# Altium schematic sheet FPGA核心板02.SchDoc
size A4
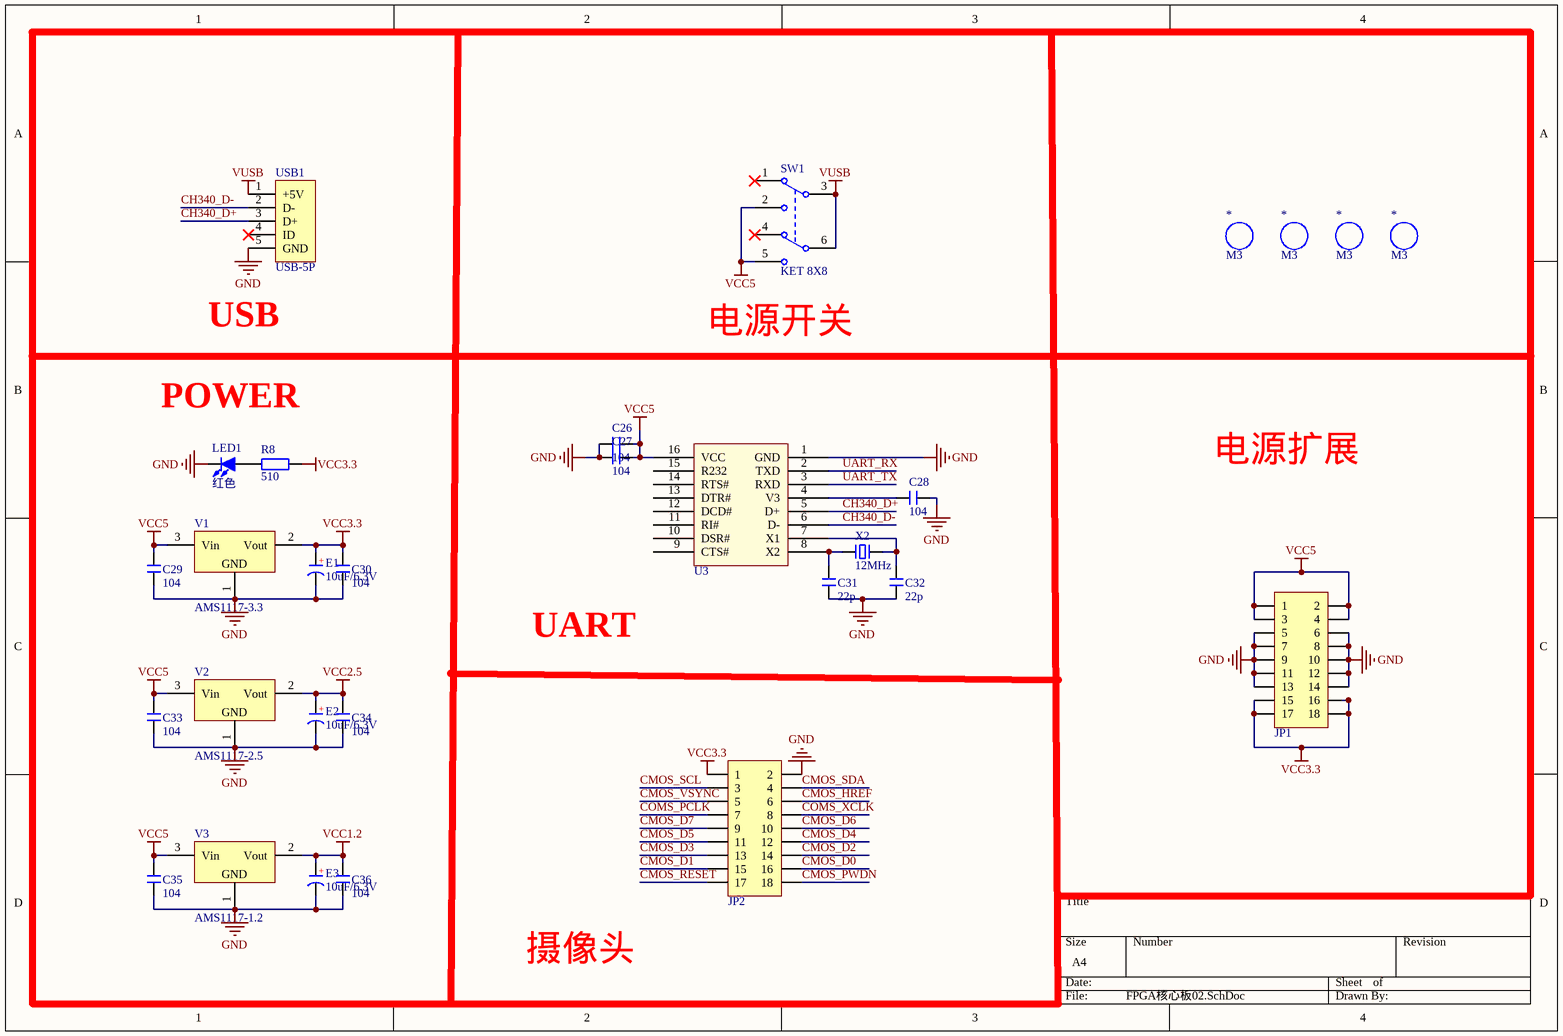
[diagram p0: FPGA核心板02.SchDoc]

## Parts
(Parts that share a designator on the sheet are numbered #1, #2 ... from top to bottom, then left to right.)
*#1  M3  [M3 125X300]
*#2  M3  [M3 125X300]
*#3  M3  [M3 125X300]
*#4  M3  [M3 125X300]
C26  104  [C 0603_L]
C27  104  [C 0603_L]
C28  104  [C 0603_L]
C29  104  [C 0603_L]
C30  104  [C 0603_L]
C31  22p  [C 0603_L]
C32  22p  [C 0603_L]
C33  104  [C 0603_L]
C34  104  [C 0603_L]
C35  104  [C 0603_L]
C36  104  [C 0603_L]
E1  10uF/6.3V  [CD A(3216)]
E2  10uF/6.3V  [CD A(3216)]
E3  10uF/6.3V  [CD A(3216)]
JP1  Header 9X2  [HDR2.54-LI-2x9P]  (value not drawn)
JP2  Header 9X2  [HDR2.54-WI-2x9P]  (value not drawn)
LED1  红色  [LED 0805B]
R8  510  [R 0603_L]
SW1  KET 8X8  [KFT DIP-8X8]
U3  CH340G  [sop16_L]  (value not drawn)
USB1  USB-5P  [USB-MICRO_B]
V1  AMS1117-3.3  [SOT223_L]
V2  AMS1117-2.5  [SOT223_L]
V3  AMS1117-1.2  [SOT223_L]
X2  12MHz  [OSC HC-49S]

## Nets
GND: C26.1 C27.1 C28.2 C29.2 C30.2 C31.1 C32.1 C33.2 C34.2 C35.1 C36.1 E1.2(K) E2.2(K) E3.2(K) JP1.5 JP1.6 JP1.7 JP1.8 JP1.9 JP1.10 JP1.11 JP1.12 JP1.13 JP1.14 JP2.2 LED1.2(K) U3.1(GND) USB1.5(GND) V1.1(GND) V2.1(GND) V3.1(GND)
VCC1.2: C36.2 E3.1(A) V3.2(Vout)
VCC2.5: C34.1 E2.1(A) V2.2(Vout)
VCC3.3: C30.1 E1.1(A) JP1.15 JP1.16 JP1.17 JP1.18 JP2.1 R8.2 V1.2(Vout)
VCC5: C26.2 C27.2 C29.1 C33.1 C35.2 JP1.1 JP1.2 JP1.3 JP1.4 SW1.2(COM2) SW1.5(COM2) U3.16(VCC) V1.3(Vin) V2.3(Vin) V3.3(Vin)
VUSB: SW1.3(NO1) SW1.6(NC2) USB1.1(+5V)
CH340_D+: U3.5(D+) USB1.3(D+)
CH340_D-: U3.6(D-) USB1.2(D-)
CMOS_D0: JP2.16
CMOS_D1: JP2.15
CMOS_D2: JP2.14
CMOS_D3: JP2.13
CMOS_D4: JP2.12
CMOS_D5: JP2.11
CMOS_D6: JP2.10
CMOS_D7: JP2.9
CMOS_HREF: JP2.6
CMOS_PWDN: JP2.18
CMOS_RESET: JP2.17
CMOS_SCL: JP2.3
CMOS_SDA: JP2.4
CMOS_VSYNC: JP2.5
COMS_PCLK: JP2.7
COMS_XCLK: JP2.8
UART_RX: U3.2(TXD)
UART_TX: U3.3(RXD)
NetC28_1: C28.1 U3.4(V3)
NetC31_2: C31.2 U3.8(X2) X2.1
NetC32_2: C32.2 U3.7(X1) X2.2
NetLED1_1: LED1.1(A) R8.1

Not connected (* = marked no-connect by the designer): SW1 1(NC1)* 4(NO2)*; U3 9(CTS#) 10(DSR#) 11(RI#) 12(DCD#) 13(DTR#) 14(RTS#) 15(R232); USB1 4(ID)*

## Notes on the sheet
- (near USB1) USB
- (near SW1) 电源开关
- POWER
- 电源扩展
- UART
- 摄像头
- (in symbol CT) +

## Library data of the parts
*#1-*#4 = M3: 铜柱孔; 版权归属: 封装库来自淘宝 ID：黄晶宝石; BOM名称: 铜柱孔; 学习资源: https://shop463601444.taobao.com
C26-C36 = C: 贴片电容; BOM名称: 无极性贴片电容; 淘宝ID: 封装库来自淘宝 ID：黄晶宝石; 联系售后: https://shop463601444.taobao.com
E1-E3 = CT: 贴片钽电容; 淘宝ID: 封装库来自淘宝 ID：黄晶宝石; BOM名称: 贴片钽电容; 联系售后: https://shop463601444.taobao.com
JP1 JP2 = Header 9X2: 9*2P接插件; 版权归属: 源创客; BOM名称: 9*2P接插件; 学习资源: www.ooocke.com
LED1 = LED-SMD: 贴片LED; 版权归属: 封装库来自淘宝 ID：黄晶宝石; BOM名称: 贴片LED; 学习资源: https://shop463601444.taobao.com
R8 = R: 贴片电阻; 版权归属: 来自淘宝 ID：黄晶宝石; BOM名称: 贴片电阻; 联系售后: https://shop463601444.taobao.com
SW1 = KET 8X8: 8*8自锁开关; 版权归属: 封装库来自淘宝 ID：黄晶宝石; BOM名称: 8*8自锁开关; 学习资源: https://shop463601444.taobao.com
USB1 = USB-5P: 微型USB母座; BOM名称: 微型USB母座; 学习资源: https://shop463601444.taobao.com
V1-V3 = AMS1117: 三端稳压芯片; BOM名称: 稳压芯片; 淘宝ID: 封装库来自淘宝 ID：黄晶宝石; 欢迎光临淘宝店铺: https://shop463601444.taobao.com
X2 = XTAL-2P: 2脚无源脚晶振; 版权归属: 源创客; BOM名称: 2脚无源脚晶振; 学习资源: www.ooocke.com